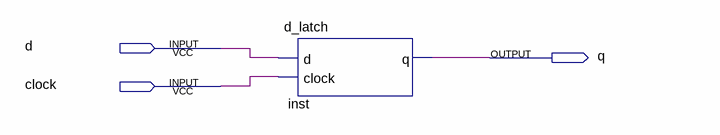
[diagram p0: schematic sheet]
// Quartus schematic dLatch.bdf as structural Verilog: 1 symbols, 3 pins
module dLatch (
  input  d,
  input  clock,
  output q
);

  d_latch inst (.d(d), .clock(clock), .q(q));
endmodule
